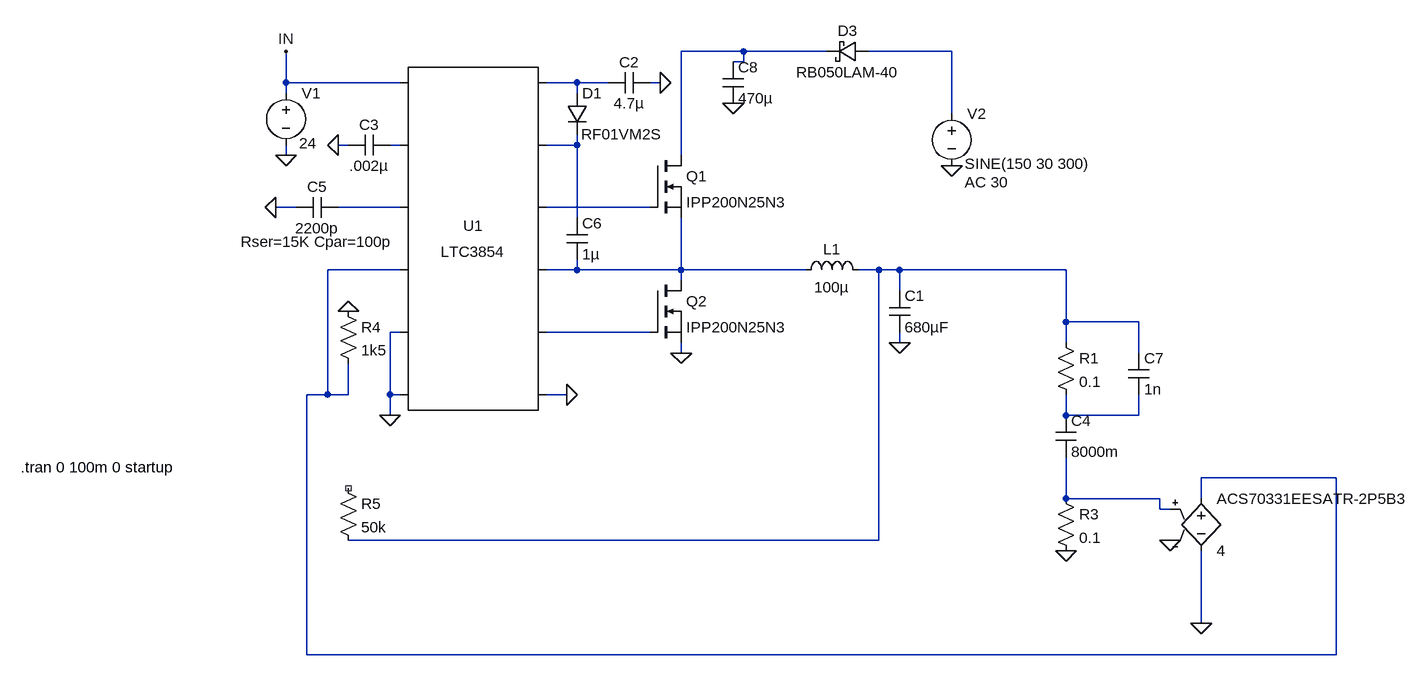
[diagram p0: schematic buck_tryhalid.asc]
buck_tryhalid.asc, the LTspice schematic file:
Version 4
SHEET 1 2364 928
WIRE 592 -64 496 -64
WIRE 720 -64 592 -64
WIRE 912 -64 784 -64
WIRE 592 -48 592 -64
WIRE 592 -48 576 -48
WIRE -112 -16 -112 -64
WIRE 64 -16 -112 -16
WIRE 336 -16 288 -16
WIRE 384 -16 336 -16
WIRE 464 -16 448 -16
WIRE -112 0 -112 -16
WIRE 336 0 336 -16
WIRE 912 32 912 -64
WIRE -16 80 -32 80
WIRE 64 80 48 80
WIRE 336 80 336 64
WIRE 336 80 288 80
WIRE -112 96 -112 80
WIRE 496 96 496 -64
WIRE -96 176 -128 176
WIRE 64 176 -32 176
WIRE 448 176 288 176
WIRE 336 192 336 80
WIRE 64 272 -48 272
WIRE 336 272 336 256
WIRE 336 272 288 272
WIRE 496 272 496 192
WIRE 496 272 336 272
WIRE 688 272 496 272
WIRE 800 272 768 272
WIRE 832 272 800 272
WIRE 1088 272 832 272
WIRE 496 288 496 272
WIRE 832 304 832 272
WIRE 1088 352 1088 272
WIRE 1200 352 1088 352
WIRE 64 368 48 368
WIRE 448 368 288 368
WIRE 832 384 832 368
WIRE 1088 384 1088 352
WIRE 496 400 496 384
WIRE 1200 400 1200 352
WIRE -48 464 -48 272
WIRE -48 464 -80 464
WIRE -16 464 -16 416
WIRE -16 464 -48 464
WIRE 48 464 48 368
WIRE 64 464 48 464
WIRE 320 464 288 464
WIRE 48 496 48 464
WIRE 1088 496 1088 464
WIRE 1200 496 1200 464
WIRE 1200 496 1088 496
WIRE 1504 592 1296 592
WIRE 1088 624 1088 560
WIRE 1232 624 1088 624
WIRE 1296 624 1296 592
WIRE 1232 640 1232 624
WIRE 1248 640 1232 640
WIRE 800 688 800 272
WIRE 800 688 -16 688
WIRE 1296 816 1296 704
WIRE -80 864 -80 464
WIRE 1504 864 1504 592
WIRE 1504 864 -80 864
FLAG 320 464 0
FLAG 496 400 0
FLAG 832 384 0
FLAG 464 -16 0
FLAG -32 80 0
FLAG -112 96 0
FLAG -112 -64 IN
FLAG -128 176 0
FLAG 912 112 0
FLAG 48 496 0
FLAG 1088 704 0
FLAG 1248 688 0
FLAG -16 336 0
FLAG 1296 816 0
FLAG 576 16 0
SYMBOL nmos 448 96 R0
SYMATTR InstName Q1
SYMATTR Value IPP200N25N3
SYMBOL ind 672 288 R270
WINDOW 0 32 56 VTop 2
WINDOW 3 5 56 VBottom 2
SYMATTR InstName L1
SYMATTR Value 100µ
SYMATTR SpiceLine Rser=140m
SYMBOL cap 816 304 R0
SYMATTR SpiceLine Rser=4.5m
SYMATTR InstName C1
SYMATTR Value 680µF
SYMBOL cap 384 0 R270
WINDOW 0 32 32 VTop 2
WINDOW 3 0 32 VBottom 2
SYMATTR InstName C2
SYMATTR Value 4.7µ
SYMBOL cap 48 64 R90
WINDOW 0 0 32 VBottom 2
WINDOW 3 32 32 VTop 2
SYMATTR InstName C3
SYMATTR Value .002µ
SYMBOL voltage -112 -16 R0
WINDOW 3 20 93 Left 2
WINDOW 123 0 0 Left 2
WINDOW 39 0 0 Left 2
SYMATTR Value 24
SYMATTR InstName V1
SYMBOL diode 320 0 R0
WINDOW 3 22 63 Left 2
SYMATTR Value RF01VM2S
SYMATTR InstName D1
SYMBOL nmos 448 288 R0
SYMATTR InstName Q2
SYMATTR Value IPP200N25N3
SYMBOL cap -32 160 R90
WINDOW 0 0 32 VBottom 2
WINDOW 3 32 32 VTop 2
WINDOW 39 53 32 VTop 2
SYMATTR InstName C5
SYMATTR Value 2200p
SYMATTR SpiceLine Rser=15K Cpar=100p
SYMBOL PowerProducts\\LTC3854 176 224 R0
SYMATTR InstName U1
SYMBOL cap 320 192 R0
SYMATTR InstName C6
SYMATTR Value 1µ
SYMBOL voltage 912 16 R0
WINDOW 3 20 93 Left 2
WINDOW 123 20 121 Left 2
WINDOW 39 0 0 Left 2
SYMATTR Value SINE(150 30 300)
SYMATTR Value2 AC 30
SYMATTR InstName V2
SYMBOL e 1296 608 R0
SYMATTR InstName ACS70331EESATR-2P5B3
SYMATTR Value 4
SYMBOL res 1072 608 R0
SYMATTR InstName R3
SYMATTR Value 0.1
SYMBOL res 1072 368 R0
SYMATTR InstName R1
SYMATTR Value 0.1
SYMBOL res -32 320 R0
SYMATTR InstName R4
SYMATTR Value 1k5
SYMBOL res -32 592 R0
SYMATTR InstName R5
SYMATTR Value 50k
SYMBOL cap 1072 496 R0
SYMATTR InstName C4
SYMATTR Value 8000m
SYMATTR Value2 IC=24
SYMBOL schottky 784 -80 R90
WINDOW 0 0 32 VBottom 2
WINDOW 3 32 32 VTop 2
SYMATTR InstName D3
SYMATTR Value RB050LAM-40
SYMATTR Description Diode
SYMATTR Type diode
SYMBOL cap 1184 400 R0
SYMATTR InstName C7
SYMATTR Value 1n
SYMBOL cap 560 -48 R0
SYMATTR SpiceLine Rser=4.5m
SYMATTR InstName C8
SYMATTR Value 470µ
TEXT -520 576 Left 2 !.tran 0 100m 0 startup

The netlist it stands for:
* buck_tryhalid.asc
M§Q1 N001 N007 N009 N009 IPP200N25N3
L1 N009 N010 100µ Rser=140m
C1 N010 0 680µF Rser=4.5m
C2 N003 0 4.7µ
C3 N004 0 .002µ
V1 IN 0 24
D1 N003 N005 RF01VM2S
M§Q2 N009 N011 0 0 IPP200N25N3
C5 N006 0 2200p Rser=15K Cpar=100p
XU1 N008 N006 N004 N005 N007 N009 0 N011 N003 IN 0 0 LTC3854
C6 N005 N009 1µ
V2 N002 0 SINE(150 30 300) AC 30
E§ACS70331EESATR-2P5B3 N008 0 N013 0 4
R3 N013 0 0.1
R1 N010 N012 0.1
R4 0 N008 1k5
R5 NC_01 N010 50k
C4 N012 N013 8000m IC=24
D3 N002 N001 RB050LAM-40
C7 N010 N012 1n
C8 N001 0 470µ Rser=4.5m
.model D D
.lib standard.dio
.model NMOS NMOS
.model PMOS PMOS
.lib standard.mos
.tran 0 100m 0 startup
.lib LTC3854.sub
.backanno
.end